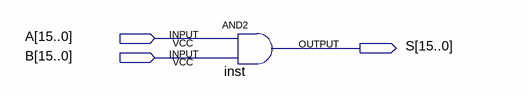
[diagram p0: schematic sheet]
// Quartus schematic ANDD.bdf as structural Verilog: 1 symbols, 3 pins
module ANDD (
  input  [15:0] A,
  input  [15:0] B,
  output [15:0] S
);

  assign S = A & B;  // AND2 inst, 16 bits wide
endmodule
